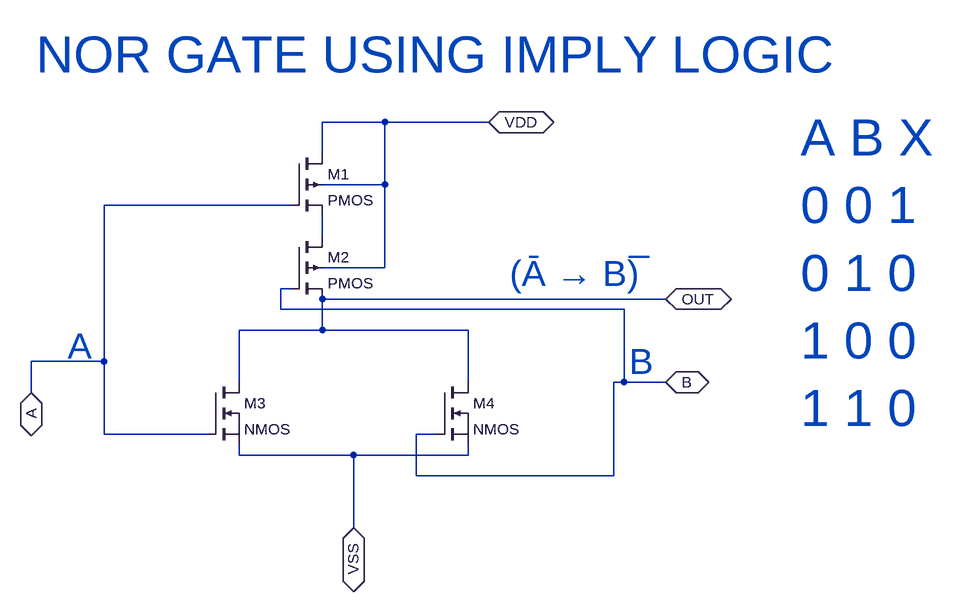
[diagram p0: schematic norgateimply.asc]
norgateimply.asc, the LTspice schematic file:
Version 4
SHEET 1 912 680
WIRE 64 -128 -32 -128
WIRE 224 -128 64 -128
WIRE -32 -80 -32 -128
WIRE 64 -32 64 -128
WIRE 64 -32 -32 -32
WIRE -80 0 -368 0
WIRE -32 48 -32 16
WIRE 64 96 64 -32
WIRE 64 96 -32 96
WIRE -80 128 -96 128
WIRE 496 144 -32 144
WIRE -96 160 -96 128
WIRE 432 160 -96 160
WIRE -32 192 -32 144
WIRE -32 192 -160 192
WIRE 192 192 -32 192
WIRE -368 240 -368 0
WIRE -368 240 -480 240
WIRE -160 272 -160 192
WIRE 192 272 192 192
WIRE 432 272 432 160
WIRE 432 272 416 272
WIRE 496 272 432 272
WIRE -480 288 -480 240
WIRE -368 352 -368 240
WIRE -208 352 -368 352
WIRE 144 352 112 352
WIRE -160 384 -160 368
WIRE 16 384 -160 384
WIRE 192 384 192 368
WIRE 192 384 16 384
WIRE 112 416 112 352
WIRE 416 416 416 272
WIRE 416 416 112 416
WIRE 16 496 16 384
FLAG 496 144 OUT
IOPIN 496 144 BiDir
FLAG -480 288 A
IOPIN -480 288 BiDir
FLAG 496 272 B
IOPIN 496 272 BiDir
FLAG 16 496 VSS
IOPIN 16 496 BiDir
FLAG 224 -128 VDD
IOPIN 224 -128 BiDir
SYMBOL pmos4 -80 -80 R0
SYMATTR InstName M1
SYMBOL pmos4 -80 48 R0
SYMATTR InstName M2
SYMBOL nmos -208 272 R0
SYMATTR InstName M3
SYMBOL nmos 144 272 R0
SYMATTR InstName M4
TEXT -424 216 Left 5 ;A
TEXT 440 240 Left 5 ;B
TEXT 256 104 Left 5 ;(Ā → B)̅
TEXT -472 -232 Left 6 ;NOR GATE USING IMPLY LOGIC
TEXT 704 -104 Left 6 ;A B X\n0 0 1\n0 1 0\n1 0 0\n1 1 0

The netlist it stands for:
* norgateimply.asc
M1 VDD A N001 VDD PMOS
M2 N001 B OUT VDD PMOS
M3 OUT A VSS VSS NMOS
M4 OUT B VSS VSS NMOS
.model NMOS NMOS
.model PMOS PMOS
.lib standard.mos
* A
* B
* (Ā → B)̅
* NOR GATE USING IMPLY LOGIC
* A B X
* 0 0 1
* 0 1 0
* 1 0 0
* 1 1 0
.backanno
.end